# EAGLE design module_proto2 (EAGLE 7.1.0)
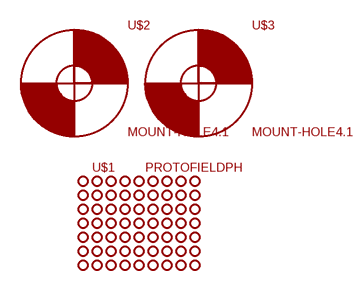
[diagram p0: schematic, sheet 1]

## Parts
U$1  PROTOFIELDPH  [PROTOFIELD-9X8_PH]
U$2  MOUNT-HOLE4.1  [4.1]
U$3  MOUNT-HOLE4.1  [4.1]

## Library data of the parts
U$1 = robocraft:PROTOFIELD: protoshield pad for modules
U$2 U$3 = robocraft:MOUNT-HOLE: Mount hole

## Board
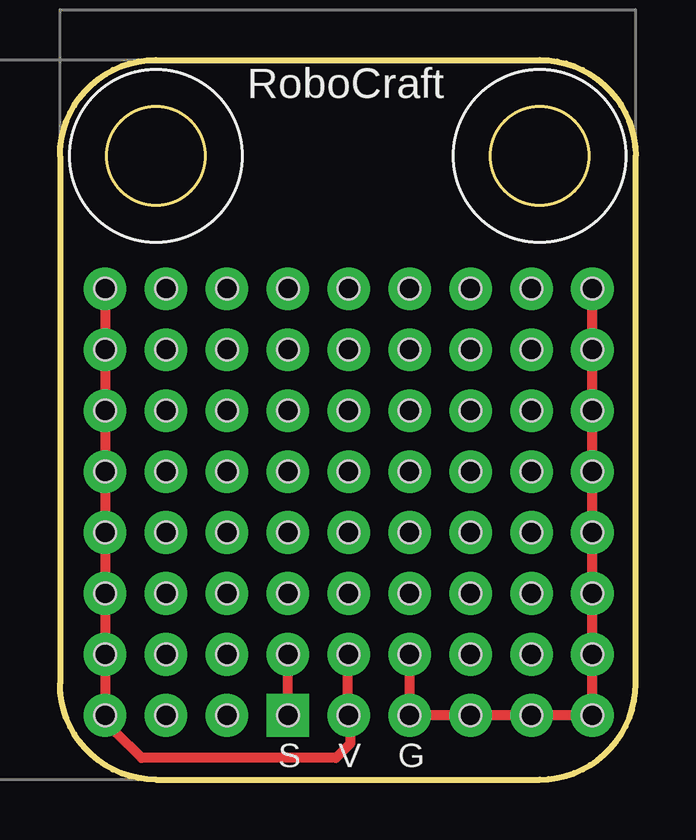
[diagram p1: board, top side]

Size 24 x 30 mm. Coordinates in mm from the lower left corner, seen from the top.
Outline: 4,0 20,0 arc90 24,4 24,26 arc90 20,30 4,30 arc90 0,26 0,4 arc90 4,0
Copper layers (1*16): Top 0.035mm / dielectric 1.5mm / Bottom 0.035mm
Design rules "default": minimum track width 10mil, minimum drill 24mil, track to track 8mil, track to pad 8mil, pad to pad 8mil, via to via 8mil, smd to smd 8mil, copper to edge 40mil, drill to drill 8mil, minimum pad ring 10mil, minimum via ring 8mil, stop-mask expansion 4mil, vias tented up to drill 0mil, thermal gap 10mil

### Footprints (pad centres in the part's own frame; a part is rotated, then mirrored left to right if it is on the bottom)
PROTOFIELD-9X8_PH = drill 0.9 pad 1.778: P$1 0,0; P$2 2.54,0; P$3 5.08,0; P$5 10.16,0; P$6 12.7,0; P$7 15.24,0; P$8 17.78,0; P$9 20.32,0; P$10 0,2.54; P$11 2.54,2.54; P$12 5.08,2.54; P$13 7.62,2.54; P$14 10.16,2.54; P$15 12.7,2.54; P$16 15.24,2.54; P$17 17.78,2.54; P$18 20.32,2.54; P$19 0,5.08; P$20 2.54,5.08; P$21 5.08,5.08; P$22 7.62,5.08; P$23 10.16,5.08; P$24 12.7,5.08; P$25 15.24,5.08; P$26 17.78,5.08; P$27 20.32,5.08; P$28 0,7.62; P$29 2.54,7.62; P$30 5.08,7.62; P$31 7.62,7.62; P$32 10.16,7.62; P$33 12.7,7.62; P$34 15.24,7.62; P$35 17.78,7.62; P$36 20.32,7.62; P$37 0,10.16; P$38 2.54,10.16; P$39 5.08,10.16; P$40 7.62,10.16; P$41 10.16,10.16; P$42 12.7,10.16; P$43 15.24,10.16; P$44 17.78,10.16; P$45 20.32,10.16; P$46 0,12.7; P$47 2.54,12.7; P$48 5.08,12.7; P$49 7.62,12.7; P$50 10.16,12.7; P$51 12.7,12.7; P$52 15.24,12.7; P$53 17.78,12.7; P$54 20.32,12.7; P$55 0,15.24; P$56 2.54,15.24; P$57 5.08,15.24; P$58 7.62,15.24; P$59 10.16,15.24; P$60 12.7,15.24; P$61 15.24,15.24; P$62 17.78,15.24; P$63 20.32,15.24; P$64 0,17.78; P$65 2.54,17.78; P$66 5.08,17.78; P$67 7.62,17.78; P$68 10.16,17.78; P$69 12.7,17.78; P$70 15.24,17.78; P$71 17.78,17.78; P$72 20.32,17.78 | drill 0.9 pad 1.778 square: P$4 7.62,0 | hole 0.9: 0,0; 2.54,0; 5.08,0; 7.62,0; 10.16,0; 12.7,0; 15.24,0; 17.78,0; 20.32,0; 20.32,2.54; 17.78,2.54; 15.24,2.54; 12.7,2.54; 10.16,2.54; 7.62,2.54; 5.08,2.54; 2.54,2.54; 0,2.54; 0,5.08; 2.54,5.08; 5.08,5.08; 7.62,5.08; 10.16,5.08; 12.7,5.08; 15.24,5.08; 17.78,5.08; 20.32,5.08; 20.32,7.62; 17.78,7.62; 15.24,7.62; 12.7,7.62; 10.16,7.62; 7.62,7.62; 5.08,7.62; 2.54,7.62; 0,7.62; 0,10.16; 2.54,10.16; 5.08,10.16; 7.62,10.16; 10.16,10.16; 12.7,10.16; 15.24,10.16; 17.78,10.16; 20.32,10.16; 20.32,12.7; 17.78,12.7; 15.24,12.7; 12.7,12.7; 10.16,12.7; 7.62,12.7; 5.08,12.7; 2.54,12.7; 0,12.7; 0,15.24; 0,17.78; 2.54,17.78; 2.54,15.24; 5.08,15.24; 5.08,17.78; 7.62,17.78; 7.62,15.24; 10.16,15.24; 10.16,17.78; 12.7,17.78; 12.7,15.24; 15.24,15.24; 15.24,17.78; 17.78,17.78; 17.78,15.24; 20.32,15.24; 20.32,17.78
4.1 = hole 4.1: 0,0

### Placement (x,y rotation side)
U$1  1.88,2.68 0 top
U$2  4,26 0 top
U$3  20,26 0 top

### Tracks (layer width: path | path; a pad name or v marks a point on that pad's centre or on a via)
N$1
  Top 0.406: 14.6,3.4 14.6,4.5
N$2
  Top 0.406: 15.3,2.7 16.4,2.7
N$3
  Top 0.406: 17.8,2.7 18.9,2.7
N$4
  Top 0.406: 20.4,2.7 21.4,2.7
N$5
  Top 0.406: 22.2,3.4 22.2,4.5
N$6
  Top 0.406: 22.2,6 22.2,7
N$7
  Top 0.406: 22.2,8.5 22.2,9.6
N$8
  Top 0.406: 22.2,11 22.2,12.1
N$9
  Top 0.406: 22.2,13.6 22.2,14.7
N$10
  Top 0.406: 22.2,16.1 22.2,17.2
N$11
  Top 0.406: 22.2,18.7 22.2,19.7
N$12
  Top 0.406: 12,3.4 12,4.5
N$13
  Top 0.406: 9.5,3.4 9.5,4.5
N$14
  Top 0.406: 12.1,2 12.1,1.5 11.5,0.9 3.4,0.9 2.3,2
N$15
  Top 0.406: 1.9,3.4 1.9,4.4
N$16
  Top 0.406: 1.9,5.9 1.9,7
N$17
  Top 0.406: 1.9,8.5 1.9,9.6
N$18
  Top 0.406: 1.9,11 1.9,12.1
N$19
  Top 0.406: 1.9,13.6 1.9,14.6
N$20
  Top 0.406: 1.9,16.1 1.9,17.1
N$21
  Top 0.406: 1.9,18.6 1.9,19.7

### Text on the board
tPlace: RoboCraft | S | V | G